# EAGLE design Adafruit 2.0 inch 240x320 IPS TFT (EAGLE 9.3.2)
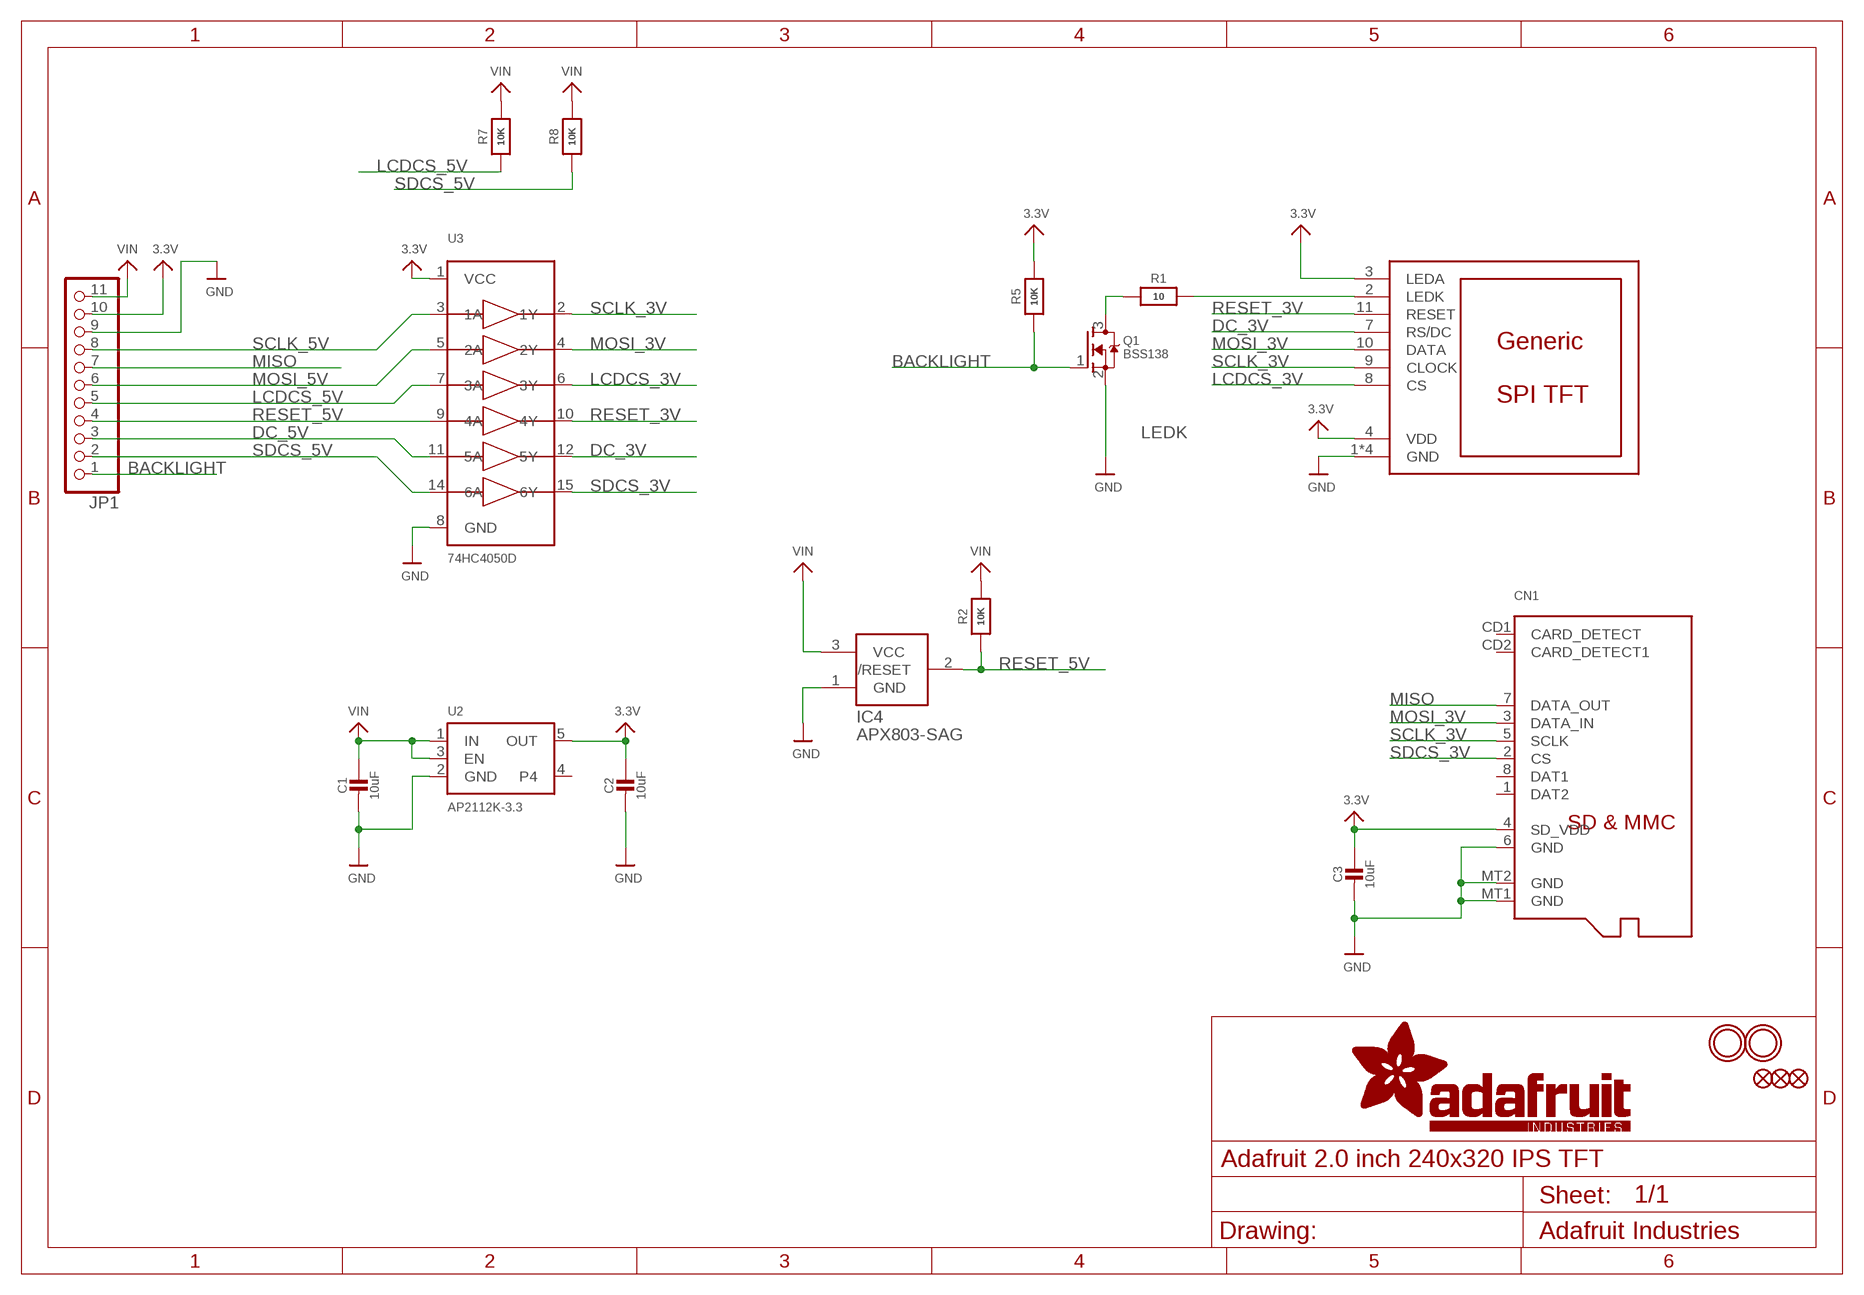
[diagram p0: schematic, sheet 1]

## Parts
C1  10uF  CAP_CERAMIC0805-NOOUTLINE  [0805-NO]
C2  10uF  CAP_CERAMIC0805-NOOUTLINE  [0805-NO]
C3  10uF  CAP_CERAMIC0805-NOOUTLINE  [0805-NO]
CN1  MICROSD  [MICROSD]
DISP1  DISP_LCD_GENERIC_SPI_2.0IN_240X320  [TFT_2.0IN_240X320_12P]
FID1  FIDUCIAL_1MM  [FIDUCIAL_1MM]
FID2  FIDUCIAL_1MM  [FIDUCIAL_1MM]
FID3  FIDUCIAL_1MM  [FIDUCIAL_1MM]
IC4  APX803-SAG  AXP083-SAG  [SOT23]
JP1  HEADER-1X1176MIL  [1X11_ROUND_76]
Q1  BSS138  MOSFET-NREFLOW  [SOT23-R]
R1  10  RESISTOR0805_NOOUTLINE  [0805-NO]
R2  10K  RESISTOR0805_NOOUTLINE  [0805-NO]
R5  10K  RESISTOR0805_NOOUTLINE  [0805-NO]
R7  10K  RESISTOR0805_NOOUTLINE  [0805-NO]
R8  10K  RESISTOR0805_NOOUTLINE  [0805-NO]
U2  AP2112K-3.3  VREG_SOT23-5  [SOT23-5]
U3  74HC4050D  [SOIC16]
U$3  MOUNTINGHOLE2.5  [MOUNTINGHOLE_2.5_PLATED]
U$4  MOUNTINGHOLE2.5  [MOUNTINGHOLE_2.5_PLATED]

## Nets
3.3V: C2.1 C3.1 CN1.4(SD_VDD) DISP1.3(LEDA) DISP1.4(VDD) JP1.10 R5.2 U2.5(OUT) U3.1(VCC)
BACKLIGHT: JP1.1 Q1.1(G) R5.1
DC_3V: DISP1.7(RS/DC) U3.12(5Y)
DC_5V: JP1.3 U3.11(5A)
GND: C1.2 C2.2 C3.2 CN1.6(GND) CN1.MT1(GND) CN1.MT2(GND) DISP1.1(GND) DISP1.5(GND) DISP1.6(GND) DISP1.12(GND) IC4.1(GND) JP1.9 Q1.2(S) U2.2(GND) U3.8(GND)
LCDCS_3V: DISP1.8(CS) U3.6(3Y)
LCDCS_5V: JP1.5 R7.1 U3.7(3A)
LEDK: Q1.3(D) R1.1
MISO: CN1.7(DATA_OUT) JP1.7
MOSI_3V: CN1.3(DATA_IN) DISP1.10(DATA) U3.4(2Y)
MOSI_5V: JP1.6 U3.5(2A)
N$1: DISP1.2(LEDK) R1.2
RESET_3V: DISP1.11(RESET) U3.10(4Y)
RESET_5V: IC4.2(/RESET) JP1.4 R2.1 U3.9(4A)
SCLK_3V: CN1.5(SCLK) DISP1.9(CLOCK) U3.2(1Y)
SCLK_5V: JP1.8 U3.3(1A)
SDCS_3V: CN1.2(CS) U3.15(6Y)
SDCS_5V: JP1.2 R8.1 U3.14(6A)
VIN: C1.1 IC4.3(VCC) JP1.11 R2.2 R7.2 R8.2 U2.1(IN) U2.3(EN)
Unconnected: CN1.1(DAT2) CN1.8(DAT1) CN1.CD1(CARD_DETECT) CN1.CD2(CARD_DETECT1) U2.4

## Library data of the parts
C1-C3 = microbuilder:CAP_CERAMIC: Ceramic Capacitors For new designs, use the packages preceded by an '_' character since they are more reliable: The following footprints should be used on most boards: _0402 - Standard footprint for regular board layouts _0603 - Standard footprint for regular board layouts _0805 - Standard footprint for regular board layouts _1206 - Standard footprint for regular board layouts For extremely tight-pitch boards where space is at a premium, the following 'micro-pitch' footprints can be used (smaller pads, no silkscreen outline, etc.): _0402MP - Micro-pitch footprint for very dense/compact boards _0603MP - Micro-pitch footprint for very dense/compact boards _0805MP - Micro-pitch footprint for very dense/compact boards _1206MP - Micro-pitch footprint for very dense/compact boards
CN1 = microbuilder:MICROSD: MicroSD/Transflash Card Holder with SPI pinout 3M: 2908-05WB-MG 4UConnector: 19656 Footprint courtesy: Adafruit Industries
DISP1 = microbuilder:DISP_LCD_GENERIC_SPI
FID1-FID3 = microbuilder:FIDUCIAL: Fiducial Alignment Points Various fiducial points for machine vision alignment.; BOM: EXCLUDE
IC4 = adafruit:AXP083
JP1 = microbuilder:HEADER-1X11
Q1 = microbuilder:MOSFET-N: N-Channel Mosfet LEGEND VDS: Voltage Drain-Source ID: Drain Current RDS(ON): Drain-Source On-State Resistance VGS(TH): Gate-Source Threshold Voltage CISS: Drain-Source Input Capacitance SOT-23 Name VDS ID RDS(ON) VGS(TH) CISS Order Number 2N7002E 60V 260mA 2.5 Ohm 2.5V @ 250uA 26.7pF @ 25V 2N7002ET1GOSTR-ND BSH103 30V 850mA 400 mOhm 400mV @ 1mA 83pF @ 24V BSH103,235-ND BSS138 60V 320mA 1.6 Ohm 1.5V @ 250uA 50pF @ 10V Mouser: 771-BSS138PW115 DMN2075U-7 20V 4.2A 38 mOhm 1V @ 250 uA 594.3pF @ 10V DMN2075U-7DICT-ND * BSS138 good choice for I2C level-shifting POWERPAK 1212-8 Name VDS ID RDS(ON) VGS(TH) CISS Order Number Si7308DN 60V 6A 58 mOhm 3V @ 250uA 665pF @ 15V SI7308DN-T1-E3CT-ND
R1 R2 R5 R7 R8 = microbuilder:RESISTOR: Resistors For new designs, use the packages preceded by an '_' character since they are more reliable: The following footprints should be used on most boards: _0402 - Standard footprint for regular board layouts _0603 - Standard footprint for regular board layouts _0805 - Standard footprint for regular board layouts _1206 - Standard footprint for regular board layouts For extremely tight-pitch boards where space is at a premium, the following 'micro-pitch' footprints can be used (smaller pads, no silkscreen outline, etc.): _0402MP - Micro-pitch footprint for very dense/compact boards _0603MP - Micro-pitch footprint for very dense/compact boards _0805MP - Micro-pitch footprint for very dense/compact boards _1206MP - Micro-pitch footprint for very dense/compact boards
U2 = microbuilder:VREG_SOT23-5: SOT23-5 Fixed Voltage Regulators Part Current Out V Out V In V Dropout θJA (°C/W) TJ (°C) Digikey Part No. ADP121 150mA 3.3V 3.4-5.5V 0.09V @ 150mA -- -- ADP121-AUJZ33R7CT-ND ADP121 150mA 3.0V 3.1-5.5V 0.09V @ 150mA -- -- ADP121-AUJZ30R7CT-ND ADP122 300mA 3.3V 3.4-5.5V 0.085V @ 300mA -- -- ADP122AUJZ-3.3-R7CT-ND ADP1712 300mA 3.3V 3.5-5.5V 0.17V @ 300mA -- -- ADP1712AUJZ-3.3-R7TR-ND AP7311 (Low Cost) 150mA 3.3V 3.5-6V 0.15V @ 150mA -- -- AP7311-33WG-7DICT-ND LD39015M18R 150mA 1.8V 1.9V-5.5V 0.08V @ 100mA -- -- 497-6977-1-ND LP2985A-33DBVR 150mA 3.3V 3.3-16V 0.28V @ 150mA 206 150 296-18479-1-ND MCP1824T-3302E/OT 300mA 3.3V 3.5V-6V 0.2V @ 300mA -- -- MCP1824T-3302E/OTCT-ND MIC5205-2.5YM5 TR 150mA 2.5V 2.7-16V 0.165V @ 150mA -- -- 576-1257-2-ND MIC5205-3.0YM5 TR 150mA 3.0V 3.2V-16V 0.165V @ 150mA -- -- 576-1258-2-ND MIC5205-3.3YM5 TR 150mA 3.3V 3.5V-16V 0.165V @ 150mA -- -- 576-1259-2-ND TPS780330220 150mA 3.3V+2.2V 3.6-5.5V 250mV Max -- -- 296-23332-1-ND TDA3663/N1,135 100mA 3.3V 3.5-45V 0.18V @ 50mA -- -- 568-5343-1-ND Max operating temp can be calculated using θJA, TJ (max junction temperature), and power in watts. Set the "Maximum Ambient Temperature" until it reaches TJ ("Max Junction Temperature"), which is the absolute limit for safe use of the regulator: Heat Sink Temperature Calculator <http://www.daycounter.com/Calculators/Heat-Sink-Temperature-Calculator.phtml> For example, With 12V source into a 3.3V LP2985 and a 30mA load, we are dissipating (12V-3.3V) * 0.03A = 0.261W. With a θJA of 206 °C/W, a TJ of 150°C, and 261mW we can safely use the chip without a heat sink up to 75°C (=147.1°C Junction Temperature).
U3 = microbuilder:74HC4050D: 6-channel level shifter 74HC4050D - 2V-6V Supply SOIC16 Digikey: 74HC4050D,653-ND Mouser: 771-74HC4050D-T TSSOP16 Digikey: 296-9215-1-ND Mouser:
U$3 U$4 = microbuilder:MOUNTINGHOLE: Mounting Hole For #2 screws (0.086"/2.18mm width, 0.094"/2.4mm hole) use 2.5mm; BOM: EXCLUDE

## Board
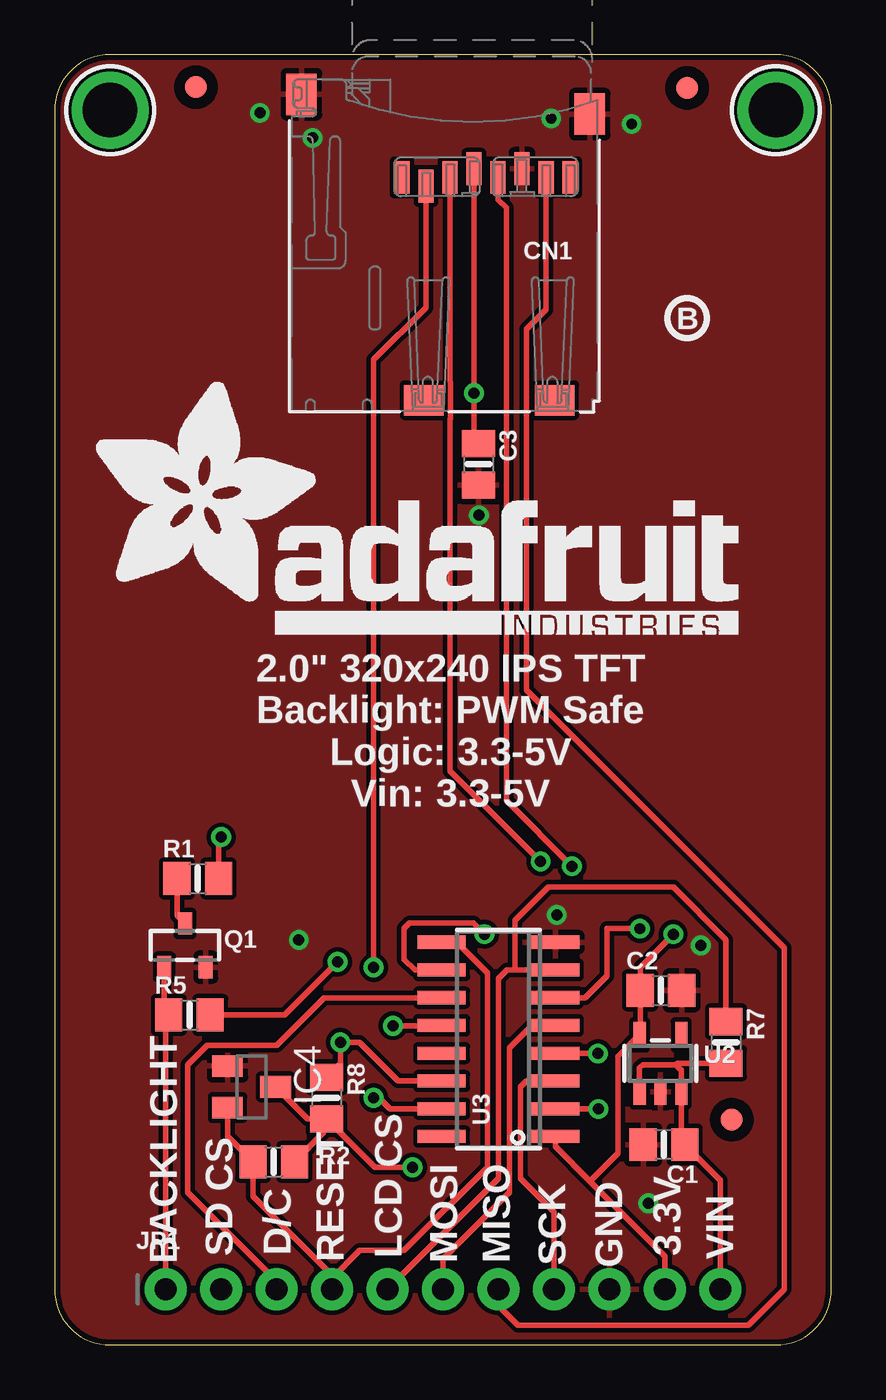
[diagram p1: board, top side]
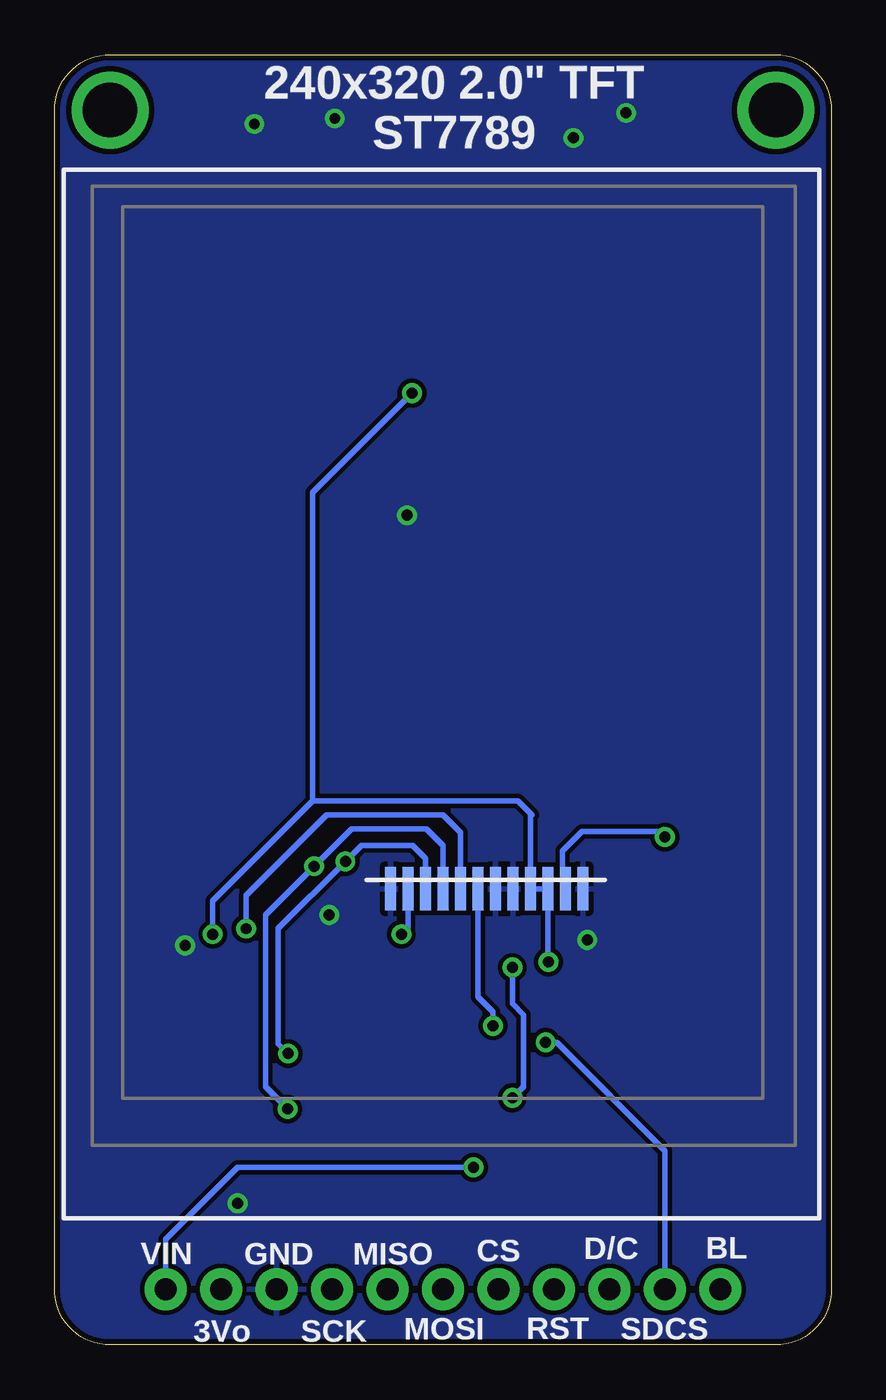
[diagram p2: board, bottom side, seen from below]

Size 35.56 x 59.05 mm. Coordinates in mm from the lower left corner, seen from the top.
Outline: 35.56,2.54 35.56,56.52 arc90 33.02,59.05 2.54,59.05 arc90 0,56.52 0,2.54 arc90 2.54,0 33.02,0 arc90 35.56,2.54
Copper layers (1*16): Top 0.035mm / dielectric 1.5mm / Bottom 0.035mm
Design rules "adafruit": minimum track width 8mil, minimum drill 15.5mil, track to track 8mil, track to pad 8mil, pad to pad 8mil, via to via 8mil, smd to smd 8mil, copper to edge 10mil, drill to drill 8mil, minimum pad ring 10mil, minimum via ring 8mil, stop-mask expansion 2mil, vias tented up to drill 20mil, thermal gap 10mil

### Footprints (pad centres in the part's own frame; a part is rotated, then mirrored left to right if it is on the bottom)
0805-NO = smd 1.24 x 1.5: 1 -0.95,0; 2 0.95,0
MICROSD = smd 0.7 x 1.5: 1 9,-10.64; 2 7.9,-10.24; 3 6.8,-10.64; 4 5.7,-11.04; 5 4.6,-10.64; 6 3.5,-11.04; 7 2.4,-10.64; 8 1.3,-10.64 | smd 1.8 x 1.4: CD1 2,-0.44; CD2 8,-0.44 | smd 1.4 x 1.9: MT1 0.4,-13.54; MT2 13.6,-14.44
TFT_2.0IN_240X320_12P = smd 0.5 x 2: 1 5.77,-13.41; 2 4.97,-13.41; 3 4.17,-13.41; 4 3.37,-13.41; 5 2.57,-13.41; 6 1.77,-13.41; 7 0.97,-13.41; 8 0.17,-13.41; 9 -0.63,-13.41; 10 -1.43,-13.41; 11 -2.23,-13.41; 12 -3.03,-13.41
FIDUCIAL_1MM = smd 1 x 1: 1 0,0
SOT23 = smd 1 x 1.4: 1 -0.95,-1.1; 2 0.95,-1.1; 3 0,1.1
1X11_ROUND_76 = drill 1 pad 1.93: 1 -12.7,0; 2 -10.16,0; 3 -7.62,0; 4 -5.08,0; 5 -2.54,0; 6 0,0; 7 2.54,0; 8 5.08,0; 9 7.62,0; 10 10.16,0; 11 12.7,0
SOT23-R = smd 0.635 x 1.016: 1 -0.95,-1; 2 0.95,-1; 3 0,1
SOT23-5 = smd 0.55 x 1.2: 1 -0.95,-1.3; 2 0,-1.3; 3 0.95,-1.3; 4 0.95,1.3; 5 -0.95,1.3
SOIC16 = smd 0.6 x 2.2: 1 -4.445,-2.6; 2 -3.175,-2.6; 3 -1.905,-2.6; 4 -0.635,-2.6; 5 0.635,-2.6; 6 1.905,-2.6; 7 3.175,-2.6; 8 4.445,-2.6; 9 4.445,2.6; 10 3.175,2.6; 11 1.905,2.6; 12 0.635,2.6; 13 -0.635,2.6; 14 -1.905,2.6; 15 -3.175,2.6; 16 -4.445,2.6
MOUNTINGHOLE_2.5_PLATED = drill 2.5 pad 3.2: P$1 0,0

### Placement (x,y rotation side)
C1  27.89,9.17 180 top
C2  27.76,16.22 0 top
C3  19.41,40.31 270 top
CN1  24.9,42.8 180 top
DISP1  17.14,34.29 0 bottom
FID1  31,10.31 0 top
FID2  6.47,57.57 0 top
FID3  28.96,57.53 0 top
IC4  9.02,11.81 270 top
JP1  17.78,2.54 0 top
Q1  5.97,18.29 0 top
R1  6.55,21.35 0 top
R2  10.03,8.38 0 top
R5  6.18,15.1 0 top
R7  30.73,13.84 270 top
R8  12.45,11.3 270 top
U2  27.73,12.88 0 top
U3  20.32,13.99 90 top
U$3  33.02,56.52 0 top
U$4  2.54,56.52 0 top
U$20  [ADAFRUIT_TEXT_30MM]  1.65,32.53 0 top
U$24  [PCBFEAT-REV-040]  28.96,46.99 0 top

### Tracks (layer width: path | path; a pad name or v marks a point on that pad's centre or on a via)
3.3V  (via drill 0.5)
  Top 0.254: JP1.10 27.94,4.06 24.51,7.49 | U3.1 22.92,9.08 24.51,7.49 | R5.2 10.53,15.1 v12.95,17.53 | 24.51,7.49 25.78,8.76 25.78,13.21 26.76,14.18 U2.5 26.81,14.21 C2.1 26.81,17.28 v28.32,18.8 | CN1.4 v19.2,43.56 19.2,41.47 C3.1
  Bottom 0.254: v12.95,17.53 12.97,17.55 DISP1.3 DISP1.4 13.78,24.2 13.72,24.26 14.35,24.89 23.75,24.89 | v28.32,18.8 28.32,20.32 23.75,24.89 | 23.75,24.89 23.75,39.01 v19.2,43.56
BACKLIGHT
  Top 0.254: Q1.1 5.02,15.31 R5.1 5.08,14.96 JP1.1
DC_3V  (via drill 0.5)
  Top 0.254: v15.49,14.61 17.7,14.61 U3.12
  Bottom 0.254: DISP1.7 16.18,18.71 16.18,15.92 15.49,15.24 v15.49,14.61
DC_5V
  Top 0.254: U3.11 12.34,15.89 10.16,13.72 6.99,13.72 6.1,12.83 6.1,6.99 10.16,2.92 JP1.3
GND  (via drill 0.5)
  other vias: 11.18,18.54 22.99,19.68 29.59,18.29 27.18,6.48 19.43,37.97 11.81,55.24 22.73,56.13 26.42,55.88 9.4,56.39
  pour Top: 0,59.05 35.56,59.05 35.56,0 0,0
  pour Bottom: 0,59.05 35.56,59.05 35.56,0 0,0
LCDCS_3V  (via drill 0.5)
  Top 0.254: U3.6 24.27,15.89 25.27,16.89 25.27,19.05 v26.8,19.05
  Bottom 0.254: v26.8,19.05 26.8,20.57 23.11,24.26 17.78,24.26 16.98,23.45 DISP1.8
LCDCS_5V
  Top 0.254: JP1.5 20.32,7.62 20.32,16.76 20.72,17.16 21.08,17.16 | 21.08,17.16 U3.7 | R7.1 30.73,18.54 28.32,20.95 22.61,20.95 21.08,19.43 21.08,17.16
LEDK
  Top 0.254: R1.1 5.6,19.66 Q1.3
MISO
  Top 0.254: CN1.7 22.5,47.39 21.59,46.48 21.59,29.98 33.4,18.17 33.4,2.54 31.75,0.89 21.21,0.89 20.32,1.78 JP1.7
MOSI_3V  (via drill 0.5)
  Top 0.254: U3.4 24.86,13.35 v24.87,13.34 | v22.25,22.12 18.1,26.27 18.1,42.37 18.13,42.4 18.13,44.07 18.1,44.1 CN1.3
  Bottom 0.254: v24.87,13.34 25.32,13.79 25.32,19.05 v22.25,22.12 21.51,22.86 19.18,22.86 18.57,22.26 DISP1.10
MOSI_5V
  Top 0.254: JP1.6 17.78,3.94 20.83,6.99 20.83,13.59 21.86,14.62 U3.5
N$1  (via drill 0.5)
  Top 0.254: R1.2 7.5,23.12 v7.62,23.24
  Bottom 0.254: v7.62,23.24 7.87,23.5 11.43,23.5 12.32,22.61 12.32,21.02 DISP1.2
RESET_3V  (via drill 0.5)
  Top 0.254: U3.10 16.49,17.16 16,17.65 16,19.05 16.26,19.3 19.18,19.3 v19.68,18.8
  Bottom 0.254: v19.68,18.8 19.38,19.11 DISP1.11
RESET_5V
  Top 0.254: U3.9 17.85,18.3 18.53,18.3 19.81,17.02 19.81,8.13 16,4.32 13.97,4.32 12.7,3.05 JP1.4 12.7,3.17 9.08,6.79 R2.1 7.92,9.55 IC4.2
SCLK_3V  (via drill 0.5)
  Top 0.254: U3.2 24.88,10.81 v24.89,10.79 | CN1.5 20.3,52.42 20.68,52.04 20.68,24.91 v23.69,21.91
  Bottom 0.254: v24.89,10.79 25.91,11.81 25.91,19.68 v23.69,21.91 21.97,23.62 18.54,23.62 17.78,22.86 DISP1.9
SCLK_5V
  Top 0.254: JP1.8 22.86,6.1 21.34,7.62 21.34,11.81 21.61,12.08 U3.3
SDCS_3V  (via drill 0.5)
  Top 0.254: U3.15 15.35,10.81 14.99,11.18 14.61,11.18 v14.61,11.3 | CN1.2 17,47.48 14.61,45.09 v14.61,17.27
  Bottom 0.254: v14.61,11.3 14.1,11.81 14.1,15.11 14.61,15.62 v14.61,17.27
SDCS_5V  (via drill 0.5)
  Top 0.254: U3.14 15.73,12.08 13.97,13.84 v13.08,13.84 13.08,12.89 R8.1
  Bottom 0.254: JP1.2 7.62,8.89 12.57,13.84 v13.08,13.84
VIN  (via drill 0.5)
  Top 0.254: U2.1 26.78,12.69 26.92,12.83 28.45,12.83 | 28.45,12.83 28.7,12.57 28.68,12.55 U2.3 28.68,9.33 C1.1 30.48,7.53 JP1.11 | 28.45,12.83 28.51,12.89 R7.2 | v16.38,8.13 14.67,8.13 R8.2 12.32,10.35 | IC4.3 11.57,10.35 12.32,10.35 | R2.2 12.32,9.72 12.32,10.35
  Bottom 0.254: JP1.11 30.48,4.83 27.18,8.13 v16.38,8.13

### Text on the board
tPlace: 2.0" 320x240 IPS TFT / Backlight: PWM Safe / Logic: 3.3-5V / Vin: 3.3-5V | BACKLIGHT | SD CS | RESET | LCD CS | D/C | MOSI | MISO | SCK | GND | 3.3V | VIN
bPlace: 240x320 2.0" TFT / ST7789 | BL | D/C | CS | MISO | GND | VIN | SDCS | RST | MOSI | SCK | 3Vo